# EAGLE design Slip Ring In-Line Breakout Board (EAGLE 9.6.2)
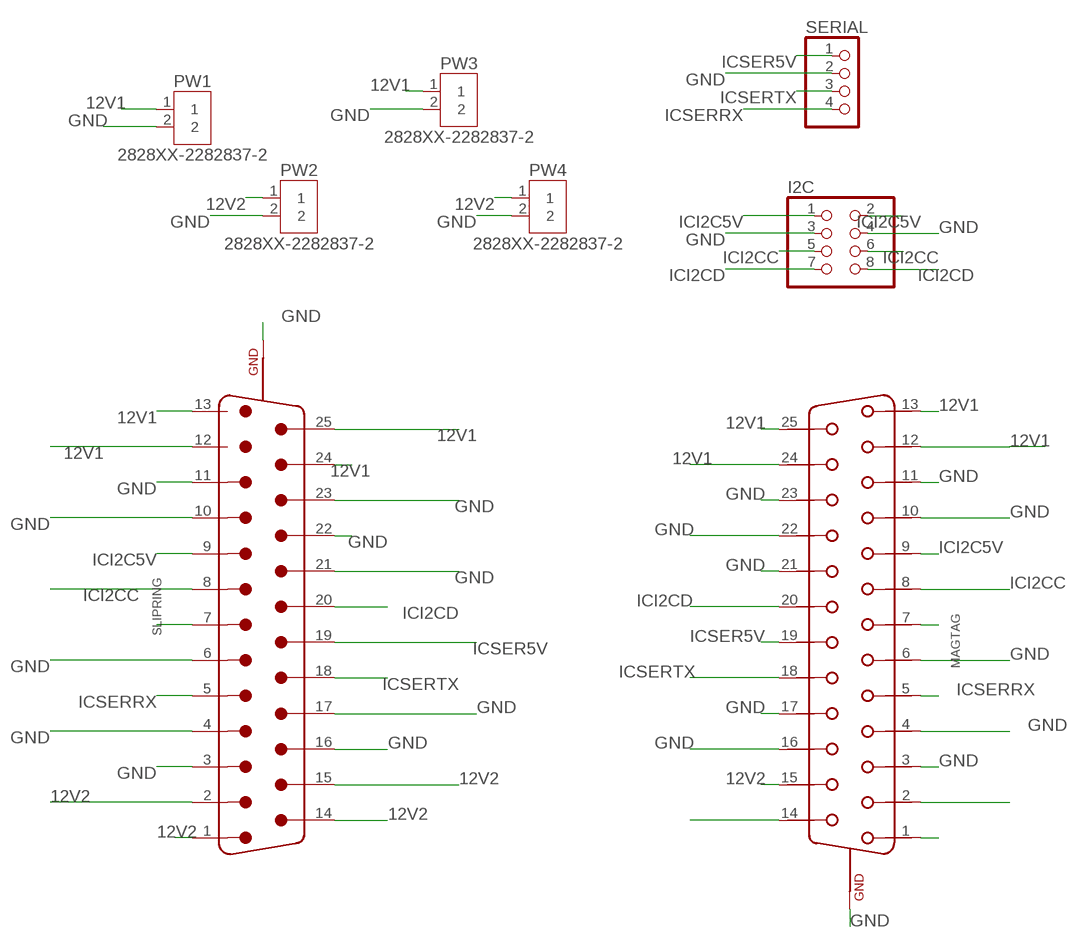
[diagram p0: schematic, sheet 1]

## Parts
I2C  PINHD-2X4  [2X04]
MAGTAG  WE-D-SUB_THT_UNC4/40_214611023  [WE-D-SUB_THT_UNC4/40_214611023]
PW1  2828XX-2282837-2  [TERMBLK_508-2N]
PW2  2828XX-2282837-2  [TERMBLK_508-2N]
PW3  2828XX-2282837-2  [TERMBLK_508-2N]
PW4  2828XX-2282837-2  [TERMBLK_508-2N]
SERIAL  PINHD-1X4  [1X04]
SLIPRING  WE-D-SUB_THT_UNC4/40_214111023  [WE-D-SUB_THT_UNC4/40_214111023]

## Nets
12V1: MAGTAG.12 MAGTAG.13 MAGTAG.24 MAGTAG.25 PW1.1 PW3.1 SLIPRING.12 SLIPRING.13 SLIPRING.24 SLIPRING.25
12V2: MAGTAG.14 MAGTAG.15 PW2.1 PW4.1 SLIPRING.1 SLIPRING.2 SLIPRING.14 SLIPRING.15
GND: I2C.3 I2C.4 MAGTAG.3 MAGTAG.4 MAGTAG.6 MAGTAG.10 MAGTAG.11 MAGTAG.16 MAGTAG.17 MAGTAG.21 MAGTAG.22 MAGTAG.23 MAGTAG.Z1(GND) MAGTAG.Z2(GND) PW1.2 PW2.2 PW3.2 PW4.2 SERIAL.2 SLIPRING.3 SLIPRING.4 SLIPRING.6 SLIPRING.10 SLIPRING.11 SLIPRING.16 SLIPRING.17 SLIPRING.21 SLIPRING.22 SLIPRING.23 SLIPRING.Z1(GND) SLIPRING.Z2(GND)
ICI2C5V: I2C.1 I2C.2 MAGTAG.9 SLIPRING.9
ICI2CC: I2C.5 I2C.6 MAGTAG.8 SLIPRING.8
ICI2CD: I2C.7 I2C.8 MAGTAG.20 SLIPRING.20
ICSER5V: MAGTAG.19 SERIAL.1 SLIPRING.19
ICSERRX: MAGTAG.5 SERIAL.4 SLIPRING.5
ICSERTX: MAGTAG.18 SERIAL.3 SLIPRING.18
N$7: SLIPRING.7
N$56: MAGTAG.1
N$59: MAGTAG.7
N$68: MAGTAG.2

## Library data of the parts
I2C = pinhead:PINHD-2X4: PIN HEADER; MF: MULTICOMP PRO; MPN: 2213S-08G; OC_NEWARK: 08N6790
MAGTAG = Wurth_Signal & Communications_WE-D-SUB:WE-D-SUB_THT_UNC4/40_214611023: WE-D-SUB Filter Solder Pin Straight Characteristics Standard type filtered with 1000 pF High attenuation: max. ≥ 40 dB @ 180 MHz Choice of UNC 4/40 or through hole Rated voltage: 100 VDC Rated current @ 20 ºC: 5 A Withstand voltage: 250 VRMS Insulation resistance: min. 1000 MΩ Operating temperature: –55 ºC to +125 ºC Applications Filtering of interfaces External connection to -printer -sensor -display Device and Package Name Note: UNC 4/40 means Size UNC 4/40 <https://katalog.we-online.de/media/images/v2/o14707v209%20Family_D-SUB-Filter_mit_geradem_Loetstift.jpg> Details see: https://katalog.we-online.de/en/pbs/D-SUB-FILTER-STRAIGHT Updated by Ella Wu 2019-09-10 2019(C) Wurth Elektronik; DATASHEET-URL: https://katalog.we-online.de/pbs/datasheet/214611023.pdf; MF: WURTH ELEKTRONIK; MOUNT: THT; MPN: 61802525123; OC_NEWARK: 16T0677; PART-NUMBER: 214611023; POLES: 25; TYPE: Female
PW1-PW4 = Connector:2828XX-2: 2 Position Wire to Board Terminal Block Horizontal with Board Datasheet <https://www.te.com.cn/commerce/DocumentDelivery/DDEController?Action=showdoc&DocId=Catalog+Section%7F1308389_EUROSTYLE_TERMINAL_BLOCKS%7F0607%7Fpdf%7FEnglish%7FENG_CS_1308389_EUROSTYLE_TERMINAL_BLOCKS_0607.pdf%7F2-282837-5>; CATEGORY: Connector; DESCRIPTION: 2 Position Wire to Board Terminal Block Horizontal with Board 5.08 mm Through Hole; MANUFACTURER: TE Connectivity; MF: AMPHENOL ANYTEK; MPN: 20020316-H021B01LF; OC_NEWARK: 59R8934; OPERATING_TEMPERATURE: -40°C to +105°C; PART_STATUS: ACTIVE; ROHS_COMPLIANCE: RoHS Compliant; SERIES: 282837; SUBCATEGORY: Terminal Block; TYPE: Side Wire Entry
SERIAL = pinhead:PINHD-1X4: PIN HEADER; MF: MOLEX; MPN: 22-28-4041; OC_NEWARK: 01AH0786
SLIPRING = Wurth_Signal & Communications_WE-D-SUB:WE-D-SUB_THT_UNC4/40_214111023: WE-D-SUB Filter Solder Pin Straight Characteristics Standard type filtered with 1000 pF High attenuation: max. ≥ 40 dB @ 180 MHz Choice of UNC 4/40 or through hole Rated voltage: 100 VDC Rated current @ 20 ºC: 5 A Withstand voltage: 250 VRMS Insulation resistance: min. 1000 MΩ Operating temperature: –55 ºC to +125 ºC Applications Filtering of interfaces External connection to -printer -sensor -display Device and Package Name Note: UNC 4/40 means Size UNC 4/40 <https://katalog.we-online.de/media/images/v2/o14707v209%20Family_D-SUB-Filter_mit_geradem_Loetstift.jpg> Details see: https://katalog.we-online.de/en/pbs/D-SUB-FILTER-STRAIGHT Updated by Ella Wu 2019-09-10 2019(C) Wurth Elektronik; DATASHEET-URL: https://katalog.we-online.de/pbs/datasheet/214111023.pdf; MF: WURTH ELEKTRONIK; MOUNT: THT; MPN: 61802525023; OC_NEWARK: 16T0676; PART-NUMBER: 214111023; POLES: 25; TYPE: Male

## Board
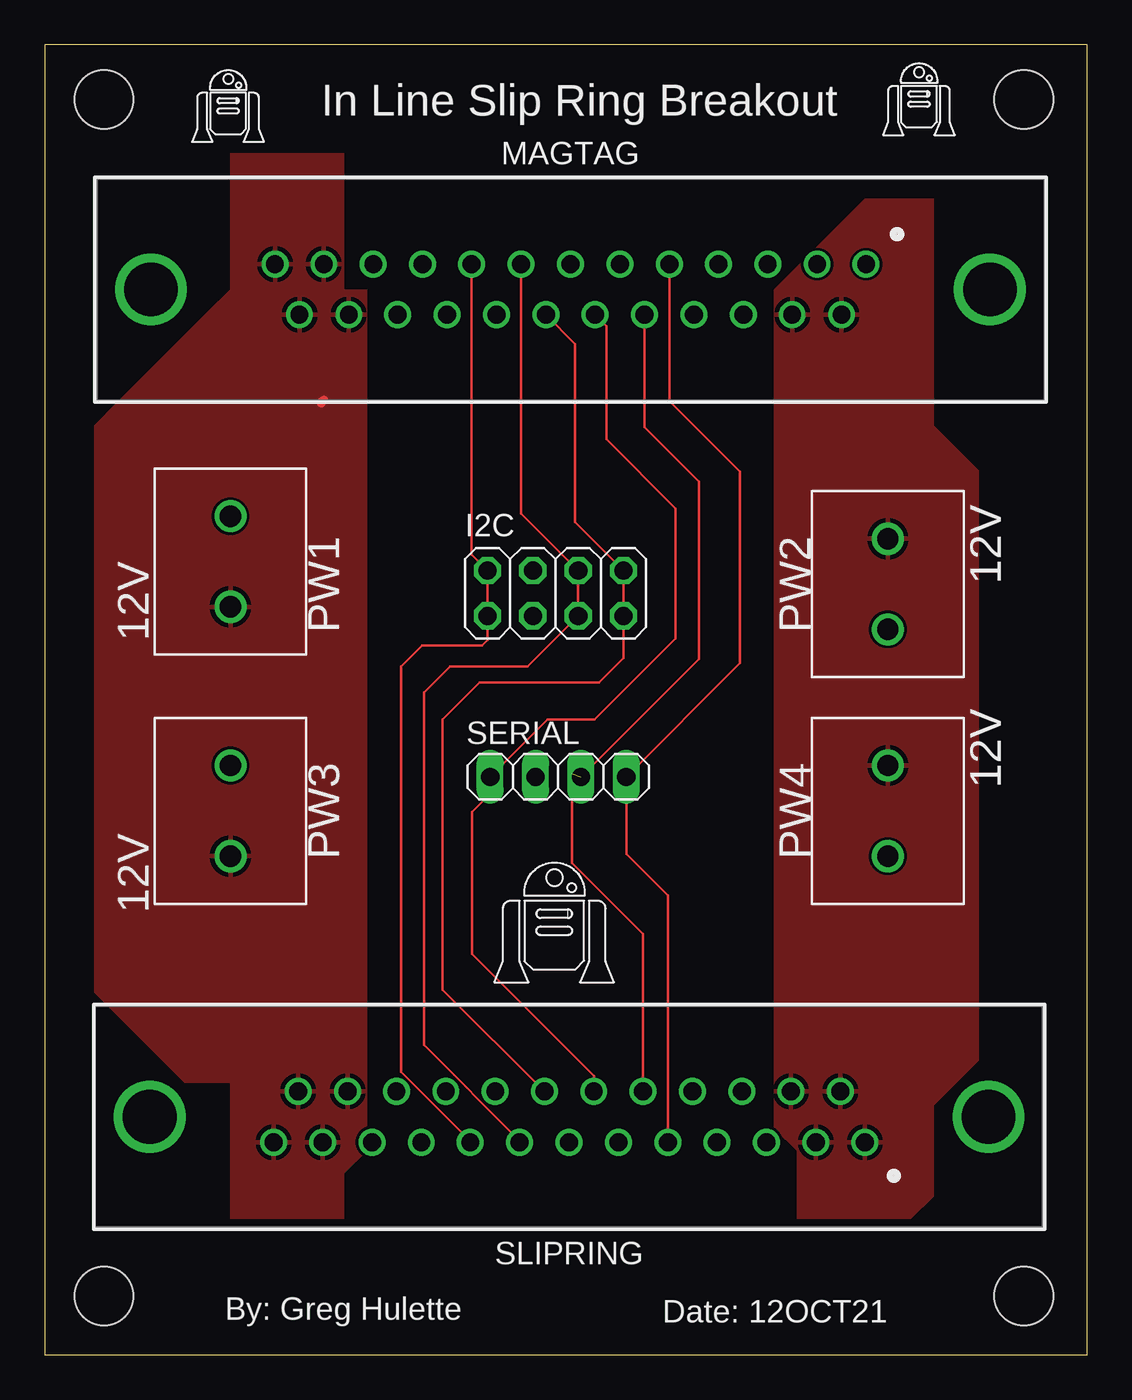
[diagram p1: board, top side]
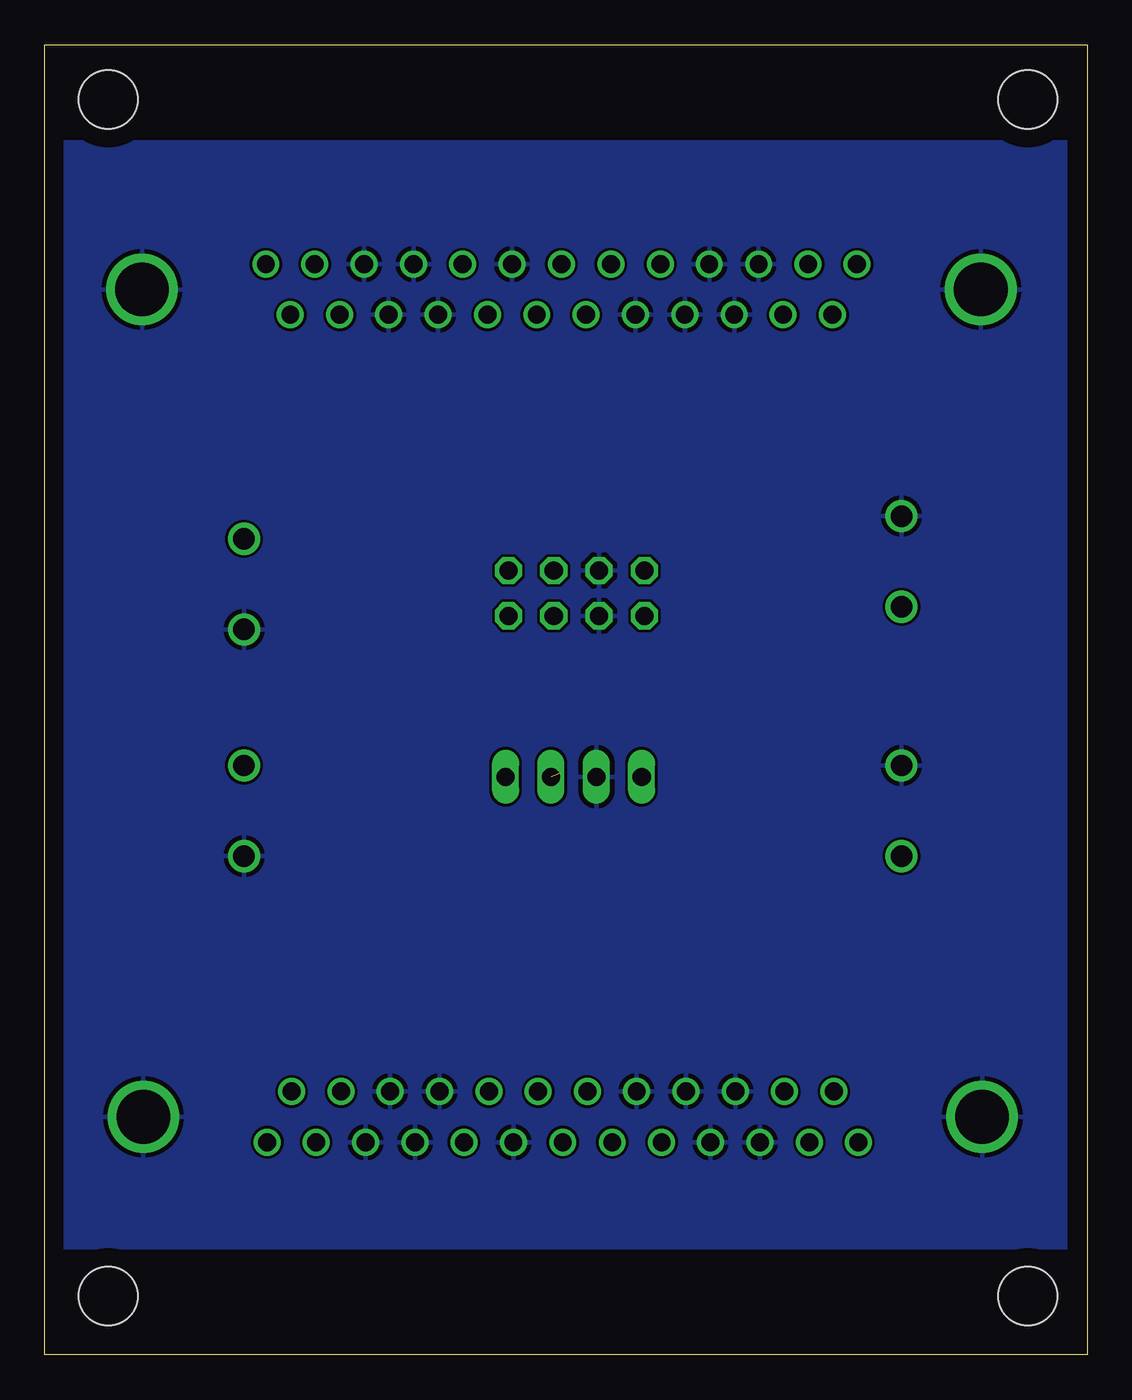
[diagram p2: board, bottom side, seen from below]

Size 58.42 x 73.41 mm. Coordinates in mm from the lower left corner, seen from the top.
Outline: 0,73.41 0,0 58.42,0 58.42,73.41 0,73.41
Copper layers (1*16): Top 0.035mm / dielectric 1.5mm / Bottom 0.035mm
Design rules "default": minimum track width 6mil, minimum drill 0.35mm, track to track 6mil, track to pad 6mil, pad to pad 6mil, via to via 6mil, smd to smd 6mil, copper to edge 40mil, drill to drill 6mil, minimum pad ring 10mil, minimum via ring 8mil, stop-mask expansion 4mil, vias tented up to drill 0mil, thermal gap 10mil
Holes 3.3 mm at 3.33,70.33 54.86,70.33 54.86,3.3 3.33,3.3

### Footprints (pad centres in the part's own frame; a part is rotated, then mirrored left to right if it is on the bottom)
2X04 = drill 1.016 octagon: 1 -3.81,-1.27; 2 -3.81,1.27; 3 -1.27,-1.27; 4 -1.27,1.27; 5 1.27,-1.27; 6 1.27,1.27; 7 3.81,-1.27; 8 3.81,1.27
WE-D-SUB_THT_UNC4/40_214611023 = drill 1: 1 16.56,1.42; 2 13.82,1.42; 3 11.05,1.42; 4 8.28,1.42; 5 5.54,1.42; 6 2.77,1.42; 7 0,1.42; 8 -2.77,1.42; 9 -5.54,1.42; 10 -8.28,1.42; 11 -11.05,1.42; 12 -13.82,1.42; 13 -16.56,1.42; 14 15.19,-1.42; 15 12.42,-1.42; 16 9.68,-1.42; 17 6.91,-1.42; 18 4.14,-1.42; 19 1.38,-1.42; 20 -1.38,-1.42; 21 -4.14,-1.42; 22 -6.91,-1.42; 23 -9.68,-1.42; 24 -12.42,-1.42; 25 -15.19,-1.42 | drill 3: Z1 -23.5,0; Z2 23.5,0
TERMBLK_508-2N = drill 1.2: 1 0,0; 2 5.08,0
1X04 = drill 1.016 long: 1 -3.81,0; 2 -1.27,0; 3 1.27,0; 4 3.81,0
WE-D-SUB_THT_UNC4/40_214111023 = drill 1: 1 -16.56,1.42; 2 -13.82,1.42; 3 -11.05,1.42; 4 -8.28,1.42; 5 -5.54,1.42; 6 -2.77,1.42; 7 0,1.42; 8 2.77,1.42; 9 5.54,1.42; 10 8.28,1.42; 11 11.05,1.42; 12 13.82,1.42; 13 16.56,1.42; 14 -15.19,-1.42; 15 -12.42,-1.42; 16 -9.68,-1.42; 17 -6.91,-1.42; 18 -4.14,-1.42; 19 -1.38,-1.42; 20 1.38,-1.42; 21 4.14,-1.42; 22 6.91,-1.42; 23 9.68,-1.42; 24 12.42,-1.42; 25 15.19,-1.42 | drill 3: Z1 -23.5,0; Z2 23.5,0

### Placement (x,y rotation side)
I2C  28.63,42.67 0 top
MAGTAG  29.46,59.69 0 top
PW1  10.41,41.91 90 top
PW2  47.24,45.72 270 top
PW3  10.41,27.94 90 top
PW4  47.24,33.02 270 top
SERIAL  28.78,32.38 0 top
SLIPRING  29.39,13.34 180 top

### Tracks (layer width: path | path; a pad name or v marks a point on that pad's centre or on a via)
12V1
  Top 0.508: 15.49,53.34 15.64,53.49
  pour Top: 16.76,67.31 16.76,59.69 18.03,59.69 18.03,11.43 16.76,10.16 16.76,7.62 10.41,7.62 10.41,15.24 7.87,15.24 2.79,20.32 2.79,52.07 4.06,53.34 9.14,58.42 10.41,59.69 10.41,67.31
12V2
  pour Top: 49.78,64.77 49.78,52.07 52.32,49.53 52.32,16.51 49.78,13.97 49.78,8.89 48.51,7.62 42.16,7.62 42.16,11.43 40.89,12.7 40.89,50.8 40.89,59.69 43.43,62.23 45.97,64.77
GND
  pour Bottom: 1.12,68.02 57.56,68.02 57.56,5.94 1.12,5.94
ICI2C5V
  Top 0.152: SLIPRING.9 23.85,11.98 19.96,15.86 19.96,38.56 21.16,39.75 24.51,39.75 24.82,40.06 I2C.1 I2C.2 23.92,44.83 MAGTAG.9
ICI2CC
  Top 0.152: SLIPRING.8 26.62,12.01 21.26,17.36 21.26,37.11 22.71,38.56 27.05,38.56 I2C.5 I2C.6 26.69,47.14 MAGTAG.8
ICI2CD
  Top 0.152: SLIPRING.20 22.3,20.46 22.3,35.61 24.36,37.67 31.06,37.67 32.44,39.04 I2C.7 I2C.8 29.72,46.66 29.72,56.64 MAGTAG.20
ICSER5V
  Top 0.152: SLIPRING.19 30.77,15.64 23.95,22.45 23.95,30.4 24.97,31.42 SERIAL.1 28.17,35.59 30.81,35.59 35.36,40.13 35.36,47.42 31.47,51.31 31.47,57.64 MAGTAG.19
ICSERRX
  Top 0.152: SLIPRING.5 34.93,25.73 32.59,28.07 SERIAL.4 38.96,38.76 38.96,49.48 35,53.44 MAGTAG.5
ICSERTX  (1 unrouted)
  Top 0.152: SLIPRING.18 33.53,23.57 29.54,27.56 29.54,32.56 | SERIAL.3 36.65,38.99 36.65,48.92 33.6,51.97 MAGTAG.18

### Text on the board
tNames: In Line Slip Ring Breakout | 12V | 12V | 12V | 12V | By: Greg Hulette | Date: 12OCT21